# Altium schematic sheet Bank2_I_O.SchDoc
size A3
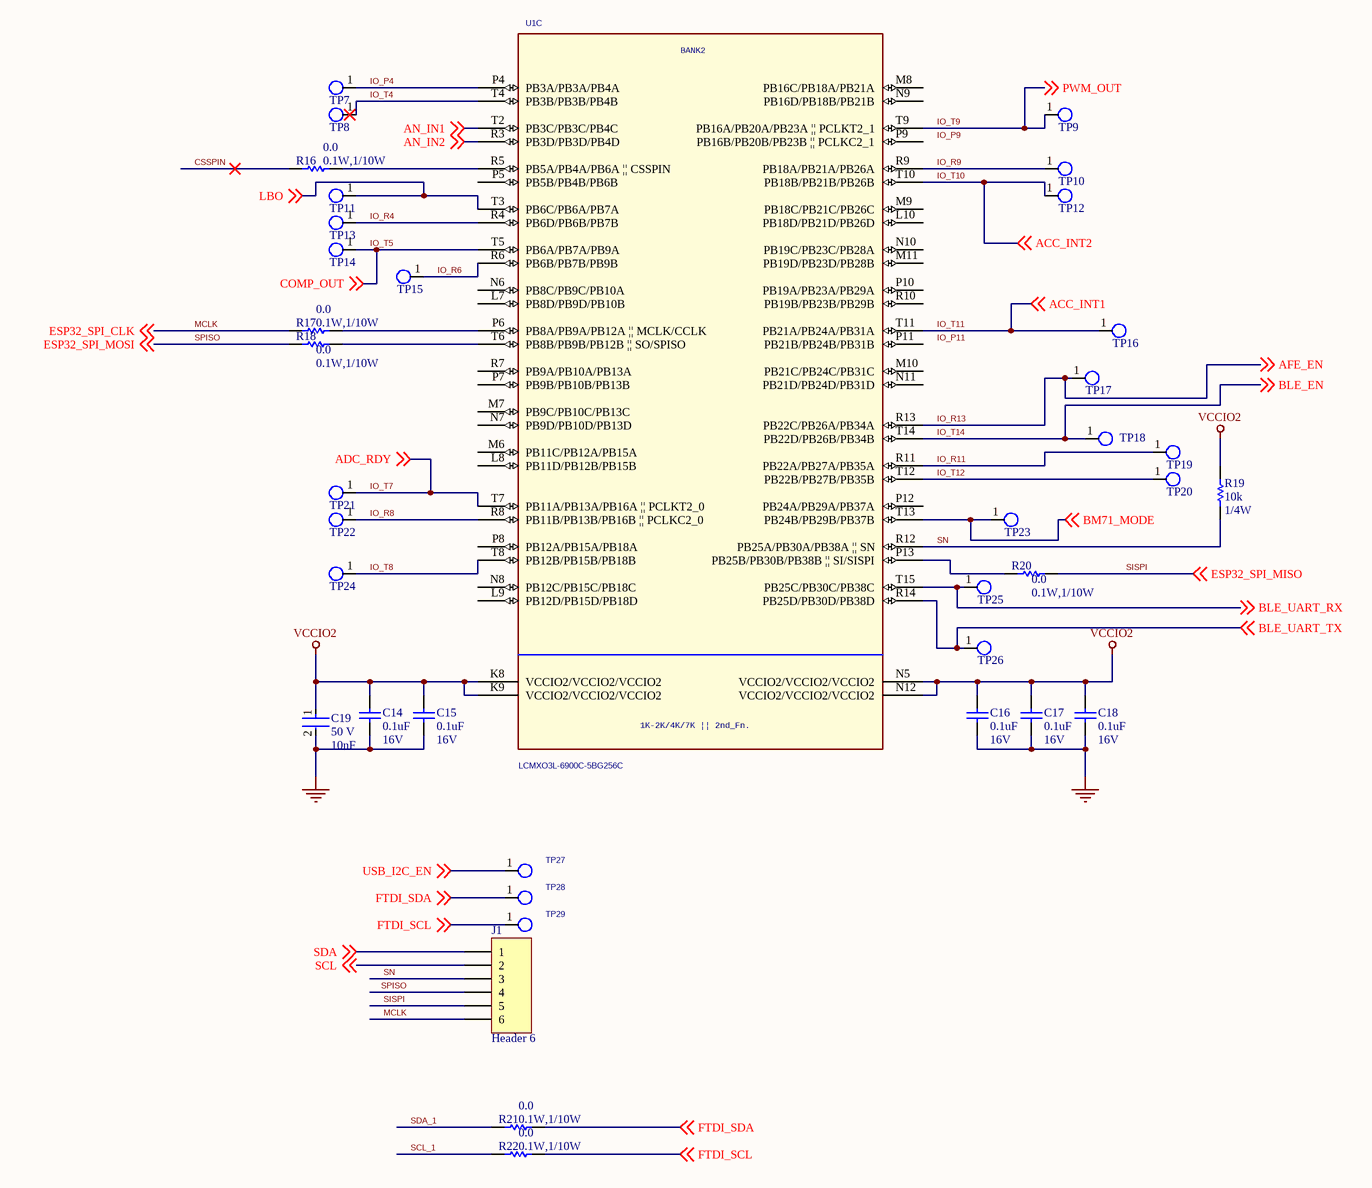
[diagram p0: Bank2_I_O.SchDoc]

## Parts
C14  value 0.1uF  Voltage: 16V  [CAPC1608X87X35ML15T15]  (hidden comment: C0603C104M4RACTU)
C15  value 0.1uF  Voltage: 16V  [CAPC1608X87X35ML15T15]  (hidden comment: C0603C104M4RACTU)
C16  value 0.1uF  Voltage: 16V  [CAPC1608X87X35ML15T15]  (hidden comment: C0603C104M4RACTU)
C17  value 0.1uF  Voltage: 16V  [CAPC1608X87X35ML15T15]  (hidden comment: C0603C104M4RACTU)
C18  value 0.1uF  Voltage: 16V  [CAPC1608X87X35ML15T15]  (hidden comment: C0603C104M4RACTU)
C19  value 10nF  Voltage: 50 V  [FP-C0805C-DN-MFG]  (hidden comment: C0805C103K5RACAUTO)
J1  Header 6  [HDR1X6]
R16  value 0.0  Power: 0.1W,1/10W  [RESC1608X55X35LL10T10]  (hidden comment: RC1608J000CS)
R17  value 0.0  Power: 0.1W,1/10W  [RESC1608X55X35LL10T10]  (hidden comment: RC1608J000CS)
R18  value 0.0  Power: 0.1W,1/10W  [RESC1608X55X35LL10T10]  (hidden comment: RC1608J000CS)
R19  value 10k  Power: 1/4W  [RESC3216X70X50NL05T20]  (hidden comment: ERJ-8GEYJ103V)
R20  value 0.0  Power: 0.1W,1/10W  [RESC1608X55X35LL10T10]  (hidden comment: RC1608J000CS)
R21  value 0.0  Power: 0.1W,1/10W  [RESC1608X55X35LL10T10]  (hidden comment: RC1608J000CS)
R22  value 0.0  Power: 0.1W,1/10W  [RESC1608X55X35LL10T10]  (hidden comment: RC1608J000CS)
TP7  Test_Point_SMD  [Test_Point_SMD]  (value not drawn)
TP8  Test_Point_SMD  [Test_Point_SMD]  (value not drawn)
TP9  Test_Point_SMD  [Test_Point_SMD]  (value not drawn)
TP10  Test_Point_SMD  [Test_Point_SMD]  (value not drawn)
TP11  Test_Point_SMD  [Test_Point_SMD]  (value not drawn)
TP12  Test_Point_SMD  [Test_Point_SMD]  (value not drawn)
TP13  Test_Point_SMD  [Test_Point_SMD]  (value not drawn)
TP14  Test_Point_SMD  [Test_Point_SMD]  (value not drawn)
TP15  Test_Point_SMD  [Test_Point_SMD]  (value not drawn)
TP16  Test_Point_SMD  [Test_Point_SMD]  (value not drawn)
TP17  Test_Point_SMD  [Test_Point_SMD]  (value not drawn)
TP18  Test_Point_SMD  [Test_Point_SMD]  (value not drawn)
TP19  Test_Point_SMD  [Test_Point_SMD]  (value not drawn)
TP20  Test_Point_SMD  [Test_Point_SMD]  (value not drawn)
TP21  Test_Point_SMD  [Test_Point_SMD]  (value not drawn)
TP22  Test_Point_SMD  [Test_Point_SMD]  (value not drawn)
TP23  Test_Point_SMD  [Test_Point_SMD]  (value not drawn)
TP24  Test_Point_SMD  [Test_Point_SMD]  (value not drawn)
TP25  Test_Point_SMD  [Test_Point_SMD]  (value not drawn)
TP26  Test_Point_SMD  [Test_Point_SMD]  (value not drawn)
TP27  tp_s_40_63  [tp_s_40_63]  (value not drawn)
TP28  tp_s_40_63  [tp_s_40_63]  (value not drawn)
TP29  tp_s_40_63  [tp_s_40_63]  (value not drawn)
U1  LCMXO3L-6900C-5BG256C  [BGA256C80P16X16_1400X1400X170]  (part C of 7)

## Nets
GND: C14.2 C15.2 C16.2 C17.2 C18.2 C19.2
VCCIO2: C14.1 C15.1 C16.1 C17.1 C18.1 C19.1 R19.1 U1.K8(VCCIO2/VCCIO2/VCCIO2) U1.K9(VCCIO2/VCCIO2/VCCIO2) U1.N5(VCCIO2/VCCIO2/VCCIO2) U1.N12(VCCIO2/VCCIO2/VCCIO2)
AN_IN1: U1.T2(PB3C/PB3C/PB4C) ; off-sheet AN_IN1
AN_IN2: U1.R3(PB3D/PB3D/PB4D) ; off-sheet AN_IN2
BLE_UART_RX: TP25.1(TP) U1.T15(PB25C/PB30C/PB38C) ; off-sheet BLE_UART_RX
BLE_UART_TX: TP26.1(TP) U1.R14(PB25D/PB30D/PB38D) ; off-sheet BLE_UART_TX
BM71_MODE: TP23.1(TP) U1.T13(PB24B/PB29B/PB37B) ; off-sheet BM71_MODE
CSSPIN: R16.1
FTDI_SCL: R22.2 TP29.1(TP) ; off-sheet FTDI_SCL
FTDI_SDA: R21.2 TP28.1(TP) ; off-sheet FTDI_SDA
IO_P4: TP7.1(TP) U1.P4(PB3A/PB3A/PB4A)
IO_R4: TP13.1(TP) U1.R4(PB6D/PB6B/PB7B)
IO_R6: TP15.1(TP) U1.R6(PB6B/PB7B/PB9B)
IO_R8: TP22.1(TP) U1.R8(PB11B/PB13B/PB16B_||_PCLKC2_0)
IO_R9: TP10.1(TP) U1.R9(PB18A/PB21A/PB26A)
IO_R11: TP19.1(TP) U1.R11(PB22A/PB27A/PB35A)
IO_R13: TP17.1(TP) U1.R13(PB22C/PB26A/PB34A) ; off-sheet AFE_EN  [also labelled AFE_EN]
IO_T4: TP8.1(TP) U1.T4(PB3B/PB3B/PB4B)
IO_T5: TP14.1(TP) U1.T5(PB6A/PB7A/PB9A) ; off-sheet COMP_OUT  [also labelled COMP_OUT]
IO_T7: TP21.1(TP) U1.T7(PB11A/PB13A/PB16A_||_PCLKT2_0) ; off-sheet ADC_RDY  [also labelled ADC_RDY]
IO_T8: TP24.1(TP) U1.T8(PB12B/PB15B/PB18B)
IO_T9: TP9.1(TP) U1.T9(PB16A/PB20A/PB23A_||_PCLKT2_1) ; off-sheet PWM_OUT  [also labelled PWM_OUT]
IO_T10: TP12.1(TP) U1.T10(PB18B/PB21B/PB26B) ; off-sheet ACC_INT2  [also labelled ACC_INT2]
IO_T11: TP16.1(TP) U1.T11(PB21A/PB24A/PB31A) ; off-sheet ACC_INT1  [also labelled ACC_INT1]
IO_T12: TP20.1(TP) U1.T12(PB22B/PB27B/PB35B)
IO_T14: TP18.1(TP) U1.T14(PB22D/PB26B/PB34B) ; off-sheet BLE_EN  [also labelled BLE_EN]
LBO: TP11.1(TP) U1.T3(PB6C/PB6A/PB7A) ; off-sheet LBO
MCLK: J1.6 R17.1 ; off-sheet ESP32_SPI_CLK  [also labelled ESP32_SPI_CLK]
SCL: J1.2 ; off-sheet SCL
SCL_1: R22.1
SDA: J1.1 ; off-sheet SDA
SDA_1: R21.1
SISPI: J1.5 R20.2 ; off-sheet ESP32_SPI_MISO  [also labelled ESP32_SPI_MISO]
SN: J1.3 R19.2 U1.R12(PB25A/PB30A/PB38A_||_SN)
SPISO: J1.4 R18.1 ; off-sheet ESP32_SPI_MOSI  [also labelled ESP32_SPI_MOSI]
USB_I2C_EN: TP27.1(TP) ; off-sheet USB_I2C_EN
NetR16_2: R16.2 U1.R5(PB5A/PB4A/PB6A_||_CSSPIN)
NetR17_2: R17.2 U1.P6(PB8A/PB9A/PB12A_||_MCLK/CCLK)
NetR18_2: R18.2 U1.T6(PB8B/PB9B/PB12B_||_SO/SPISO)
NetR20_1: R20.1 U1.P13(PB25B/PB30B/PB38B_||_SI/SISPI)

Not connected (* = marked no-connect by the designer): U1 L7(PB8D/PB9D/PB10B) L8(PB11D/PB12B/PB15B) L9(PB12D/PB15D/PB18D) L10(PB18D/PB21D/PB26D) M6(PB11C/PB12A/PB15A) M7(PB9C/PB10C/PB13C) M8(PB16C/PB18A/PB21A) M9(PB18C/PB21C/PB26C) M10(PB21C/PB24C/PB31C) M11(PB19D/PB23D/PB28B) N6(PB8C/PB9C/PB10A) N7(PB9D/PB10D/PB13D) N8(PB12C/PB15C/PB18C) N9(PB16D/PB18B/PB21B) N10(PB19C/PB23C/PB28A) N11(PB21D/PB24D/PB31D) P5(PB5B/PB4B/PB6B) P7(PB9B/PB10B/PB13B) P8(PB12A/PB15A/PB18A) P9(PB16B/PB20B/PB23B_||_PCLKC2_1) P10(PB19A/PB23A/PB29A) P11(PB21B/PB24B/PB31B) P12(PB24A/PB29A/PB37A) R7(PB9A/PB10A/PB13A) R10(PB19B/PB23B/PB29B)

## Notes on the sheet
- Labels drawn without touching a wire or pin: IO_P9, IO_P11
- Title
- Size:
- Date:
- A3
- Number:
- Time:
- Revision:
- Sheet
- of
- File:
- (in symbol LCMXO3L-1K/2K/4K/7K-BG256, part C) BANK2; 1K-2K/4K/7K || 2nd_Fn.

## Library data of the parts
C14-C18 = CMP-2006-03067-1: Ceramic Capacitor 0.1uF 16V +-10% X7R0603; Manufacturer: Kemet; Alternative1: C1608X7R1E104K TDK; Alternative2: CC0603KRX7R8BB104 Yageo; Alternative3: GRM188R72A104KA35D Murata; Part Number: C0603C104M4RACTU; Package / Case: 0603
C19 = CMP-03020-006206-1: CAP CER 10000PF 50V X7R 0805; Manufacturer: KEMET; Material: Ceramic; Temperature Coefficient: 30ppm/°C; Alternative1: GRM21BR72A103KA01L Murata; Alternative2: C0805F103K5RACTU KEMET; Alternative3: 08055C103JAT2A Kyocera AVX; Height: 0.88mm; Temperature Characteristic: X7R; Part Number: C0805C103K5RACAUTO; ComponentLink2URL: https://content.kemet.com/datasheets/KEM_C1003_C0G_SMD.pdf; RoHS: TRUE; Temperature: -55°C to +125°C; Temperature Range Low: -55°C; ComponentLink2Description: Datasheet; Package / Case: C0805C-DN; Lead Free: Yes
J1 = Header 6: Header, 6-Pin; LatestRevisionDate: 17-Jul-2002; LatestRevisionNote: Re-released for DXP Platform.; Publisher: Altium Limited
R16-R18 R20-R22 = CMP-2000-06972-1: Chip Resistor, 0 Ohm, +/- 5%, 0.1 W, -55 to 155 degC, 0603 (1608 Metric), RoHS, Tape and Reel; Manufacturer: Samsung-Electro-Mechanics-America,-Inc.; Tolerance: Jumper; Alternative1: RC0603JR-130RL Yageo; Alternative2: RC0603JR-100RL Yageo; Alternative3: CRCW0603-0000Z0EA Vishay; Manufacturer URL: http://www.samsungsem.com/global/index.jsp; Features: MoistureResistant; Mounting Technology: SurfaceMount; Series: RC; Package / Case: 0603(1608Metric); Category: Resistors; Operating Temperature: -55°C~155°C; Datasheet URL: http://static6.arrow.com/aropdfconversion/3cece72dd289ffbadc164fbcd05f638dd7240f7b/rc_datasheet_150330.pdf.pdf?authToken=eyJ0eXAiOiJKV1QiLCJhbGciOiJIUzI1NiJ9.eyJTZXNzaW9uSWQiOiJtY3ZlYXdxYmptZXdpdXdyeG1ha2FxdWciLCJEb3dubG9hZFR5cGUiOiJEYXRhc2hlZXRzIiwiaXNzIjoic2VsZiIsImF1ZCI6Imh0dHA6Ly9kYXRhc2hlZXRhdXRoLmFycm93LmNvbSIsImV4cCI6MTQ3Njg1OTQ5NiwibmJmIjoxNDc2ODU5Mzc2fQ.1rZWSrRNyHkP6J5YmszFzS2kzmlbN9BKNvWJ4ACiP-Q; Datasheet Version: 09/2015; Composition: ThickFilm; Package Description: 2-Pin Chip Resistor, Body 1.6 x 0.8 mm; Height: 0.022"(0.55mm); Family: ChipResistor-SurfaceMount; Temperature Coefficient: -; Size / Dimension: 0.063"Lx0.031"W(1.60mmx0.80mm); Part Number: RC1608J000CS
R19 = CMP-2003-00545-1: Res Thick Film 1206 10k Ohms 5% 1/4W; Manufacturer: Panasonic; Alternative1: CR1206F-10KFI TT Welwyn; Alternative2: WR12X1002FGL Walsin Technologies; Alternative3: CR1206-FX-1002ELF Bourns; Part Number: ERJ-8GEYJ103V; Package / Case: 1206
TP27-TP29 = TP_S_40_63: Square test point, 40mil inner diameter, 63mil outer diameter; Assy: DNI; Class: IO
U1 = LCMXO3L-1K/2K/4K/7K-BG256: IC FPGA 6864LUTS 256BGA; Manufacturer: Lattice semi; Source Part: LCMXO3L-1K/2K/4K/7K-BG256A.Normal; SPLIT_INST: TRUE; SWAP_INFO: (S1+S2+S3+S4+S5+S6+S7); Name: I16790692; Primitive: DEFAULT; Implementation Type: <none>; Location X-Coordinate: 0; Source Library: D:\DESIGN_DOC\XO3\LATTICEORCADCAPTURESCHEMATICLIBRARYOLB\LATTICEORCADCAPTURESCHEMATICLIBRARYOLB\LATTICE_SYM\LATTICEPLDS.OLB; Power Pins Visible: False; Location Y-Coordinate: 0; Color: Default; Source Package: LCMXO3L-1K/2K/4K/7K-BG256; Graphic: LCMXO3L-1K/2K/4K/7K-BG256A.Normal; Manufacturer Part Number: LCMXO3L-6900C-5BG256C; Digikey P/N: 220-1886-ND